# Altium schematic sheet shcematics.SchDoc: Ultra-Precision low speed ramp generator for low current calibration
size A2; PageSetup: Record=PageOptions|CenterHorizontal=True|CenterVertical=True|PrintScale=0.52|XCorrection=1.00|YCorrection=1.00|PrintKind=0|BorderSize=5000000|LeftOffset=0|BottomOffset=0|Orientation=2|PaperLength=1000|PaperWidth=1000|Scale=100|PaperSource=7|PrintQuality=-3|MediaType=1|DitherType=10|PrintScaleMode=1|PaperKind=A4|PaperIndex=9
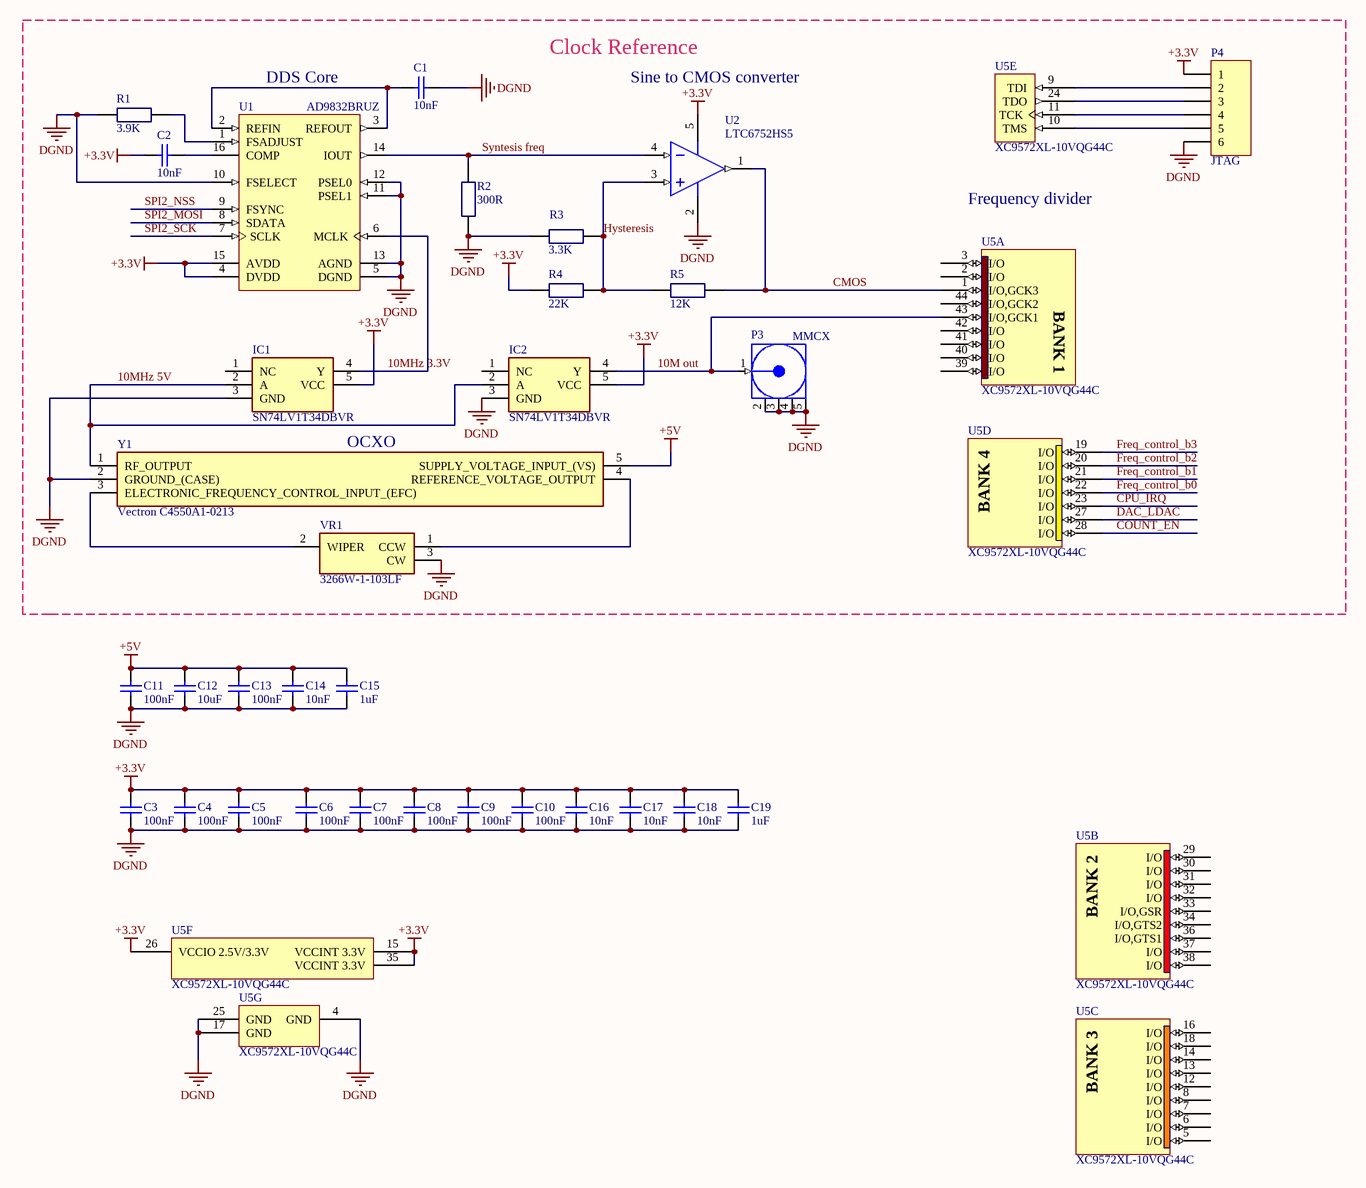
[diagram p0: shcematics.SchDoc]

## Parts
C1  10nF  [CAP 0603]
C2  10nF  [CAP 0603]
C3  100nF  [CAP 0603]
C4  100nF  [CAP 0603]
C5  100nF  [CAP 0603]
C6  100nF  [CAP 0603]
C7  100nF  [CAP 0603]
C8  100nF  [CAP 0603]
C9  100nF  [CAP 0603]
C10  100nF  [CAP 0603]
C11  100nF  [CAP 0603]
C12  10uF  [CAP 0603]
C13  100nF  [CAP 0603]
C14  10nF  [CAP 0603]
C15  1uF  [CAP 0603]
C16  10nF  [CAP 0603]
C17  10nF  [CAP 0603]
C18  10nF  [CAP 0603]
C19  1uF  [CAP 0603]
IC1  SN74LV1T34DBVR  [SOT95P280X145-5N]
IC2  SN74LV1T34DBVR  [SOT95P280X145-5N]
P3  MMCX  [MMCX2.54-V5]
P4  JTAG  [HDR1X6]
R1  3.9K  [1608[0603]]
R2  300R  [Yegeo 0603]
R3  3.3K  [Yegeo 0603]
R4  22K  [Yegeo 0603]
R5  12K  [Yegeo 0603]
U1  AD9832BRUZ  [ADI-RU-16_N]
U2  LTC6752HS5  [TI-DBV5_N]
U5  XC9572XL-10VQG44C  [VQG44_N]  (parts A,B,C,D,E,F,G of 7)
VR1  3266W-1-103LF  [3266W]
Y1  Vectron C4550A1-0213  [C4550C508SV120RFSA11128MHZ]

## Blocks framed on the sheet
Clock Reference: C1 C2 IC1 IC2 P3 P4 R1-R5 U1 U2 U5 VR1 Y1

## Nets
+3.3V: C2.1 C3.2 C4.2 C5.2 C6.2 C7.2 C8.2 C9.2 C10.2 C16.2 C17.2 C18.2 C19.2 IC1.5(VCC) IC2.5(VCC) P4.1 R4.2 U1.4(DVDD) U1.15(AVDD) U2.5(V+) U5.15(VCCINT_3.3V) U5.26(VCCIO_2.5V/3.3V) U5.35(VCCINT_3.3V)
+5V: C11.2 C12.2 C13.2 C14.2 C15.2 Y1.5(SUPPLY_VOLTAGE_INPUT_(VS))
DGND: C1.2 C3.1 C4.1 C5.1 C6.1 C7.1 C8.1 C9.1 C10.1 C11.1 C12.1 C13.1 C14.1 C15.1 C16.1 C17.1 C18.1 C19.1 IC1.3(GND) IC2.3(GND) P3.2(GND) P3.3(GND) P3.4(GND) P3.5(GND) P4.6 R1.2 R2.1(A) R3.2 U1.5(DGND) U1.10(FSELECT) U1.11(PSEL1) U1.12(PSEL0) U1.13(AGND) U2.2(V-) U5.4(GND) U5.17(GND) U5.25(GND) VR1.3(CW) Y1.2(GROUND_(CASE))
10M out: IC2.4(Y) P3.1(Signal) U5.43(I/O,GCK1)
10MHz 3.3V: IC1.4(Y) U1.6(MCLK)
10MHz 5V: IC1.2(A) IC2.2(A) Y1.1(RF_OUTPUT)
CMOS: R5.1(A) U2.1(OUT) U5.1(I/O,GCK3)
COUNT_EN: U5.28(I/O)
CPU_IRQ: U5.23(I/O)
DAC_LDAC: U5.27(I/O)
Freq_control_b0: U5.22(I/O)
Freq_control_b1: U5.21(I/O)
Freq_control_b2: U5.20(I/O)
Freq_control_b3: U5.19(I/O)
Hysteresis: R3.1(A) R4.1(A) R5.2 U2.3(IN+)
SPI2_MOSI: U1.8(SDATA)
SPI2_NSS: U1.9(FSYNC)
SPI2_SCK: U1.7(SCLK)
Syntesis freq: R2.2 U1.14(IOUT) U2.4(IN-)
NetC1_1: C1.1 U1.2(REFIN) U1.3(REFOUT)
NetC2_2: C2.2 U1.16(COMP)
NetP4_2: P4.2 U5.9(TDI)
NetP4_3: P4.3 U5.24(TDO)
NetP4_4: P4.4 U5.11(TCK)
NetP4_5: P4.5 U5.10(TMS)
NetR1_1: R1.1(A) U1.1(FSADJUST)
NetVR1_1: VR1.1(CCW) Y1.4(REFERENCE_VOLTAGE_OUTPUT)
NetVR1_2: VR1.2(WIPER) Y1.3(ELECTRONIC_FREQUENCY_CONTROL_INPUT_(EFC))

Not connected (* = marked no-connect by the designer): IC1 1(NC); IC2 1(NC); U5 2(I/O) 3(I/O) 5(I/O) 6(I/O) 7(I/O) 8(I/O) 12(I/O) 13(I/O) 14(I/O) 16(I/O) 18(I/O) 29(I/O) 30(I/O) 31(I/O) 32(I/O) 33(I/O,GSR) 34(I/O,GTS2) 36(I/O,GTS1) 37(I/O) 38(I/O) 39(I/O) 40(I/O) 41(I/O) 42(I/O) 44(I/O,GCK2)

## Notes on the sheet
- (near U1) DDS Core
- Sine to CMOS converter
- Frequency divider
- (near Y1) OCXO
- (in symbol XC9572XL-10VQG44C, part A) BANK 1
- (in symbol XC9572XL-10VQG44C, part B) BANK 2
- (in symbol XC9572XL-10VQG44C, part C) BANK 3
- (in symbol XC9572XL-10VQG44C, part D) BANK 4

## Library data of the parts
C1-C19 = Cap Semi: Capacitor (Semiconductor SIM Model); Order: CC0603KRX7R8BB104; Published: 8-Jun-2000; LatestRevisionDate: 29-May-2009; LatestRevisionNote: IPC-7351 Footprint Added.; PackageReference: C1206; Publisher: Altium Limited; PackageDescription: Chip Capacitor
  C1 C2 C14 C16-C18: Value: 10nF
  C3-C11 C13: Value: 100nF
  C12: Value: 10uF
  C15 C19: Value: 1uF
IC1 IC2 = SN74LV1T34DBVR: Integrated Circuit; Manufacturer_Name: Texas Instruments; Datasheet Link: http://www.ti.com/lit/gpn/sn74lv1t34; Height: 1.45mm; Manufacturer_Part_Number: SN74LV1T34DBVR; Mouser Part Number: 595-SN74LV1T34DBVR; Mouser Price/Stock: https://www.mouser.co.uk/ProductDetail/Texas-Instruments/SN74LV1T34DBVR?qs=8sOby8ZxZLE4ekkxA3S6Wg%3D%3D; Arrow Part Number: SN74LV1T34DBVR; Arrow Price/Stock: https://www.arrow.com/en/products/sn74lv1t34dbvr/texas-instruments?region=nac
P3 = COAX-M: RF Coaxial PCB Connector, MMCX; Thru-Hole, Vertical Mount Plug,  50 Ohm Impedance; PackageDocument: Rev. A, 16-Jun-1997; PCB_Layout: Complies with manufacturer's recommendation.; DrillSize: Corresponds to nominal value.; Published: 15-Jul-2004; LatestRevisionDate: 15-Jul-2004; LatestRevisionNote: Component Replaced.; DatasheetDocument: 30-May-2003; PackageReference: 908-21103; Publisher: Altium Limited; ComponentLink1Description: Manufacturer Link; ComponentLink1URL: http://www.amphenolrf.com/
P4 = Header 6: Header, 6-Pin; LatestRevisionDate: 17-Jul-2002; LatestRevisionNote: Re-released for DXP Platform.; Publisher: Altium Limited
R1-R5 = Resistor 0805: Order: ERA-3AEB49R9V; Avail: 20
  R1: Value: 3.9K
  R2: Value: 300R
  R3: Value: 3.3K
  R4: Value: 22K
  R5: Value: 12K
U1 = AD9832BRUZ: 25 MHz Direct Digital Synthesizer, Waveform Generator, 10-Bit, Serial, RU-16, 96 Tube, Pb-Free; Master fclk: 25MHz; Resolution (Bits): 10bit; Tuning Word Width (bits): 32bit; REFCLK Multiplier: No; Compliance Range (V): 1.35V; FS Iout (mA nom): 4mA; I Supply total (max): 15mA; DatasheetVersion: Rev. C; PackageVersion: Nov-2002; PackageReference: RU-16; PackageDescription: 16-Lead Thin Shrink Small Outline Package [TSSOP]; I/O Interface: Serial; Code_JEDEC: MO-153AB; ComponentLink1Description: Manufacturer URL; ComponentLink1URL: www.analog.com; ComponentLink2Description: Datasheet; ComponentLink2URL: http://www.analog.com/static/imported-files/data_sheets/AD9832.pdf; ComponentLink3Description: Package Specification; ComponentLink3URL: http://www.analog.com/static/imported-files/packages/36244347913743854010197452789RU16.pdf
U2 = OPA353NA/250: High-Speed, Single-Supply, Rail-to-Rail Operational Amplifier MicroAmplifier(TM) Series, 2.7 to 5.5 V, -40 to 85 degC, 5-pin SOT23 (DBV5), Green (RoHS & no Sb/Br); Manufacturer: Texas Instruments; CMRR(Min)(dB): 76; GBW(Typ)(MHz): 44; IIB(Max)(pA): 10; Iq per channel(Max)(mA): 8; Number of Channels: 1; Offset Drift(Typ)(uV/C): 5; Packing: SMALL T&R; Rating: Catalog; Slew Rate(Typ)(V/us): 22; Sub Family: High Output Current Amplifier (>=50mA), Low Input Bias Current Amp (<=10pA), Low Supply Voltage Amplifier (<=2.7V), Precision Amplifier; Total Supply Voltage(Max)(+5V is 5, +/-5V is 10): 5.5; Total Supply Voltage(Min)(+5V is 5, +/-5V is 10): 2.7; DatasheetVersion: SBOS103; PackageVersion: 4073253-4/K, 03/2006; PackageReference: DBV5; PackageDescription: 5-Pin Plastic Small Outline, Body 1.6 x 2.9 mm, Pitch 0.95 mm; Supplier 1: Digi-Key; Supplier Part Number 1: OPA353NATR-ND; Supplier 2: Digi-Key; Supplier Part Number 2: OPA353NACT-ND; Supplier 3: Digi-Key; Supplier Part Number 3: OPA353NADKR-ND; Supplier 4: Farnell; Supplier Part Number 4: 1207049; Supplier 5: Farnell; Supplier Part Number 5: 1207049RL; Supplier 6: Newark; Supplier Part Number 6: 35C1895; Supplier 7: Mouser; Supplier Part Number 7: 595-OPA353NA/250; Eco-Plan: Green (RoHS & no Sb/Br); Vio (25C)(Max)(mV): 8; Mounting Technology: Surface Mount; Code_JEDEC: MO-178; PartNumber: OPA353NA/250; ComponentLink1Description: Manufacturer URL; ComponentLink1URL: http://www.ti.com/; ComponentLink2Description: Datasheet; ComponentLink2URL: http://www.ti.com/lit/ds/symlink/opa353.pdf; ComponentLink3Description: Package Specification; ComponentLink3URL: http://www.ti.com/litv/pdf/mpds018i
U5 = XC9572XL-10VQG44C: FastFLASH XC900XL, 3.3V High-Performance 72 Macrocell CPLD, 34 User I/Os, 44-Pin VQFP, Speed Grade 10, Commercial Grade, Pb-Free; Published: 8-Sep-2006; LatestRevisionDate: 18-Nov-2009; LatestRevisionNote: Updated to datasheet version 2.5 May-2009.; DatasheetVersion: ver2.0 Apr-2007; PackageVersion: ver1.2, Jun-2004; PackageReference: VQG44; Publisher: Altium Limited; PackageDescription: 44-Pin Very Thin Quad Flat Pack (VQG44) - Pb-Free; Supplier 1: Digi-Key; Supplier Part Number 1: 122-1448-ND; Supplier 2: Farnell; Supplier Part Number 2: 1605849; Supplier 3: Newark; Supplier Part Number 3: 12N2472; Code_JEDEC: MS-026-ACB; ComponentLink1Description: XC9572XL Datasheet; ComponentLink1URL: http://www.xilinx.com/support/documentation/data_sheets/ds057.pdf; ComponentLink2Description: VQG44 Package Drawing; ComponentLink2URL: http://www.xilinx.com/support/documentation/package_specs/vq44.pdf; ComponentLink3Description: XC9500XL Documents; ComponentLink3URL: http://www.xilinx.com/support/documentation/xc9500xl.htm; ComponentLink4Description: Xilinx.com Home; ComponentLink4URL: http://www.xilinx.com
VR1 = 3266W-1-103LF: Variable Resistor; Manufacturer_Name: Bourns; Datasheet Link: https://datasheet.datasheetarchive.com/originals/distributors/SFDatasheet-6/sf-000139907.pdf; Manufacturer_Part_Number: 3266W-1-103LF; Mouser Part Number: 652-3266W-1-103LF; Mouser Price/Stock: https://www.mouser.co.uk/ProductDetail/Bourns/3266W-1-103LF?qs=QKnmwoPQUtNACBkIqMvstg%3D%3D; Arrow Part Number: 3266W-1-103LF; Arrow Price/Stock: https://www.arrow.com/en/products/3266w-1-103lf/bourns?region=europe
Y1 = C4550C508SV120RFSA1112.8MHZ: Crystal or Oscillator; Height: 11.25mm; Manufacturer_Name: Vectron; Manufacturer_Part_Number: Vectron C4550A1-0213